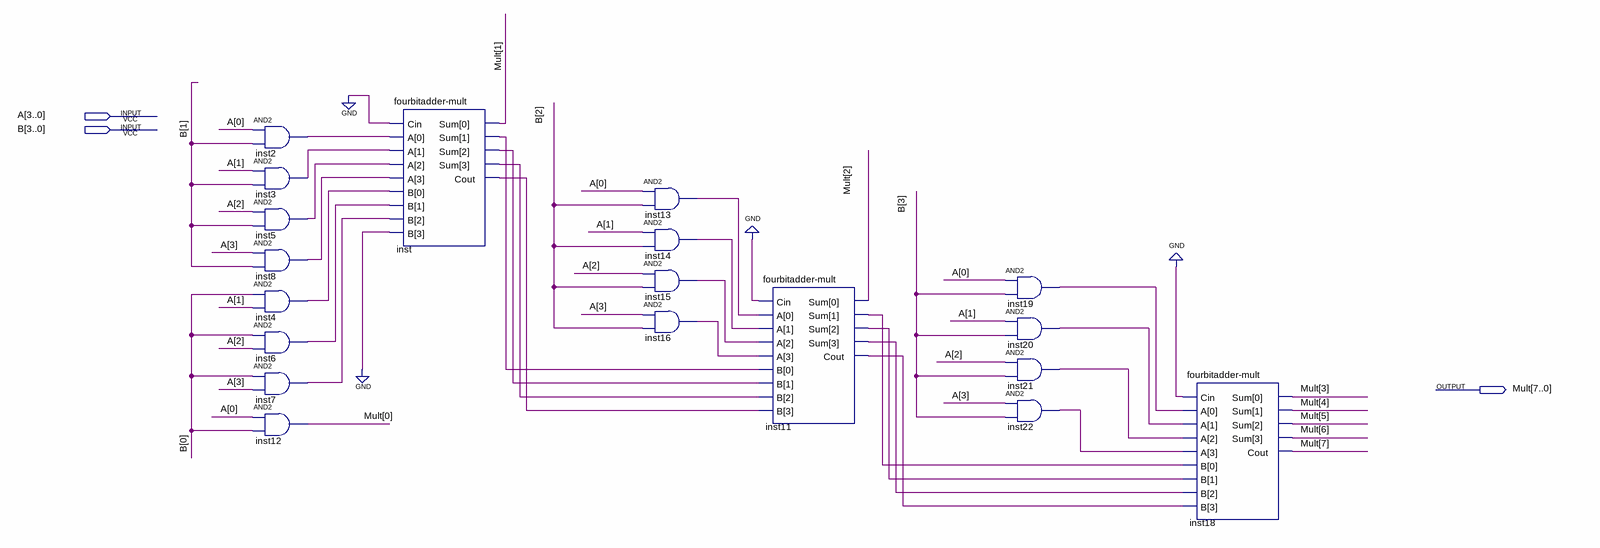
[diagram p0: schematic sheet]
// Quartus schematic Mult4x4.bdf as structural Verilog: 19 symbols, 3 pins
module Mult4x4 (
  input  [3:0] A,
  input  [3:0] B,
  output [7:0] Mult
);

  wire inst2_out, inst3_out, inst4_out, inst5_out, inst6_out, inst7_out, inst8_out, inst11_cout, inst11_sum,
       inst11_sum_2, inst11_sum_3, inst13_out, inst14_out, inst15_out, inst16_out, inst19_out, inst20_out,
       inst21_out, inst22_out, inst_cout, inst_sum, inst_sum_2, inst_sum_3;

  and inst2 (inst2_out, A[0], B[1]);
  and inst3 (inst3_out, A[1], B[1]);
  and inst5 (inst5_out, A[2], B[1]);
  and inst8 (inst8_out, A[3], B[1]);
  and inst4 (inst4_out, B[0], A[1]);
  and inst6 (inst6_out, B[0], A[2]);
  and inst7 (inst7_out, B[0], A[3]);
  and inst12 (Mult[0], A[0], B[0]);
  \fourbitadder-mult  inst (
    .Cin(1'b0), .A({inst8_out, inst5_out, inst3_out, inst2_out}),
    .B({1'b0, inst7_out, inst6_out, inst4_out}), .Sum({inst_sum_3, inst_sum_2, inst_sum, Mult[1]}),
    .Cout(inst_cout));
  and inst13 (inst13_out, A[0], B[2]);
  and inst14 (inst14_out, A[1], B[2]);
  and inst15 (inst15_out, A[2], B[2]);
  and inst16 (inst16_out, A[3], B[2]);
  \fourbitadder-mult  inst11 (
    .Cin(1'b0), .A({inst16_out, inst15_out, inst14_out, inst13_out}),
    .B({inst_cout, inst_sum_3, inst_sum_2, inst_sum}),
    .Sum({inst11_sum_3, inst11_sum_2, inst11_sum, Mult[2]}), .Cout(inst11_cout));
  and inst19 (inst19_out, A[0], B[3]);
  and inst20 (inst20_out, A[1], B[3]);
  and inst21 (inst21_out, A[2], B[3]);
  and inst22 (inst22_out, A[3], B[3]);
  \fourbitadder-mult  inst18 (
    .Cin(1'b0), .A({inst22_out, inst21_out, inst20_out, inst19_out}),
    .B({inst11_cout, inst11_sum_3, inst11_sum_2, inst11_sum}), .Sum(Mult[6:3]), .Cout(Mult[7]));
endmodule
